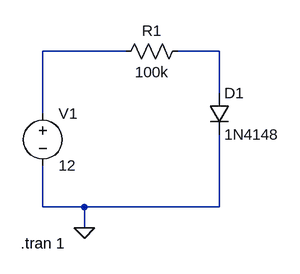
[diagram p0: schematic A01 - Simulacao.asc]
A01 - Simulacao.asc, the LTspice schematic file:
Version 4
SHEET 1 880 680
WIRE 208 -288 80 -288
WIRE 352 -288 288 -288
WIRE 352 -224 352 -288
WIRE 80 -192 80 -288
WIRE 80 -48 80 -112
WIRE 144 -48 80 -48
WIRE 352 -48 352 -160
WIRE 352 -48 144 -48
WIRE 144 -16 144 -48
FLAG 144 -16 0
SYMBOL voltage 80 -208 R0
WINDOW 123 0 0 Left 0
WINDOW 39 0 0 Left 0
SYMATTR InstName V1
SYMATTR Value 12
SYMBOL res 304 -304 R90
WINDOW 0 0 56 VBottom 2
WINDOW 3 32 56 VTop 2
SYMATTR InstName R1
SYMATTR Value 100k
SYMBOL diode 336 -224 R0
SYMATTR InstName D1
SYMATTR Value 1N4148
TEXT 46 8 Left 2 !.tran 1

The netlist it stands for:
* A01 - Simulacao.asc
V1 N001 0 12
R1 N002 N001 100k
D1 N002 0 1N4148
.model D D
.lib standard.dio
.tran 1
.backanno
.end